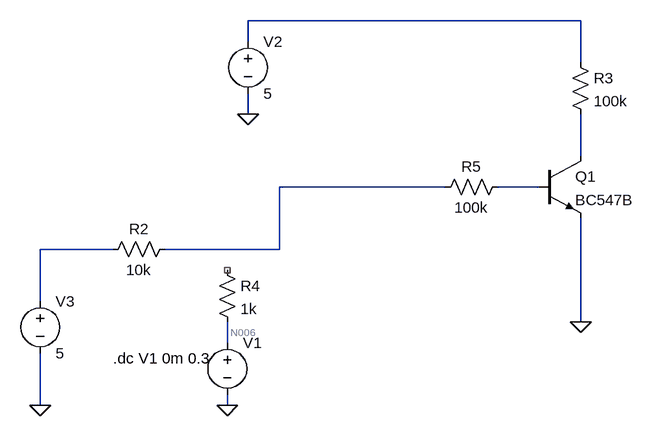
[diagram p0: schematic off_hook_sensor_with_npn.asc]
off_hook_sensor_with_npn.asc, the LTspice schematic file:
Version 4
SHEET 1 880 680
WIRE 544 -160 32 -160
WIRE 32 -128 32 -160
WIRE 544 -96 544 -160
WIRE 32 -16 32 -48
WIRE 544 48 544 -16
WIRE 336 96 80 96
WIRE 480 96 416 96
WIRE -176 192 -288 192
WIRE 80 192 -96 192
WIRE 80 192 80 96
WIRE -288 272 -288 192
WIRE 544 304 544 144
WIRE 0 336 0 304
WIRE -288 432 -288 352
WIRE 0 432 0 416
FLAG 32 -16 0
FLAG -288 432 0
FLAG 0 432 0
FLAG 544 304 0
SYMBOL voltage 0 320 R0
WINDOW 3 27 101 Left 2
WINDOW 123 0 0 Left 0
WINDOW 39 0 0 Left 0
SYMATTR Value ""
SYMATTR InstName V1
SYMBOL voltage 32 -144 R0
WINDOW 123 0 0 Left 0
WINDOW 39 0 0 Left 0
SYMATTR InstName V2
SYMATTR Value 5
SYMBOL voltage -288 256 R0
WINDOW 123 0 0 Left 0
WINDOW 39 0 0 Left 0
SYMATTR InstName V3
SYMATTR Value 5
SYMBOL res -80 176 R90
WINDOW 0 0 56 VBottom 2
WINDOW 3 32 56 VTop 2
SYMATTR InstName R2
SYMATTR Value 10k
SYMBOL res -16 208 R0
SYMATTR InstName R4
SYMATTR Value 1k
SYMBOL npn 480 48 R0
SYMATTR InstName Q1
SYMATTR Value BC547B
SYMBOL res 528 -112 R0
SYMATTR InstName R3
SYMATTR Value 100k
SYMBOL res 432 80 R90
WINDOW 0 0 56 VBottom 2
WINDOW 3 32 56 VTop 2
SYMATTR InstName R5
SYMATTR Value 100k
TEXT -176 360 Left 2 !.dc V1 0m 0.3

The netlist it stands for:
* off_hook_sensor_with_npn.asc
V1 N006 0
V2 N001 0 5
V3 N005 0 5
R2 N003 N005 10k
R4 NC_01 N006 1k
Q1 N002 N004 0 0 BC547B
R3 N001 N002 100k
R5 N004 N003 100k
.model NPN NPN
.model PNP PNP
.lib standard.bjt
.dc V1 0m 0.3
.backanno
.end

* Results of the author's LTspice run, read from the files saved beside the schematic
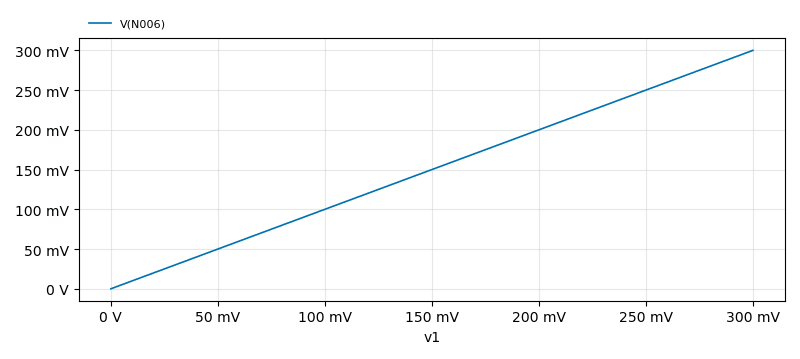
[diagram p1: DC transfer characteristic of off_hook_sensor_with_npn.asc, plotted from the saved traces]
* DC transfer characteristic, 1 run:
*   V(N006): 0 V at v1=0 V, 300 mV at v1=300 mV, min 0 V, max 300 mV